# EasyEDA Pro project ProPrj_Line_follow_3_2025-06-26.epro, schematic Schematic1
Board Name: Board1; Create Date: 2025-04-30; Page Name: P1; Project Name: Line_follow_3; Schematic Name: Schematic1; Update Date: 2025-05-01; Company: EasyEDA.com; Page Size: A2; Version: V1.0
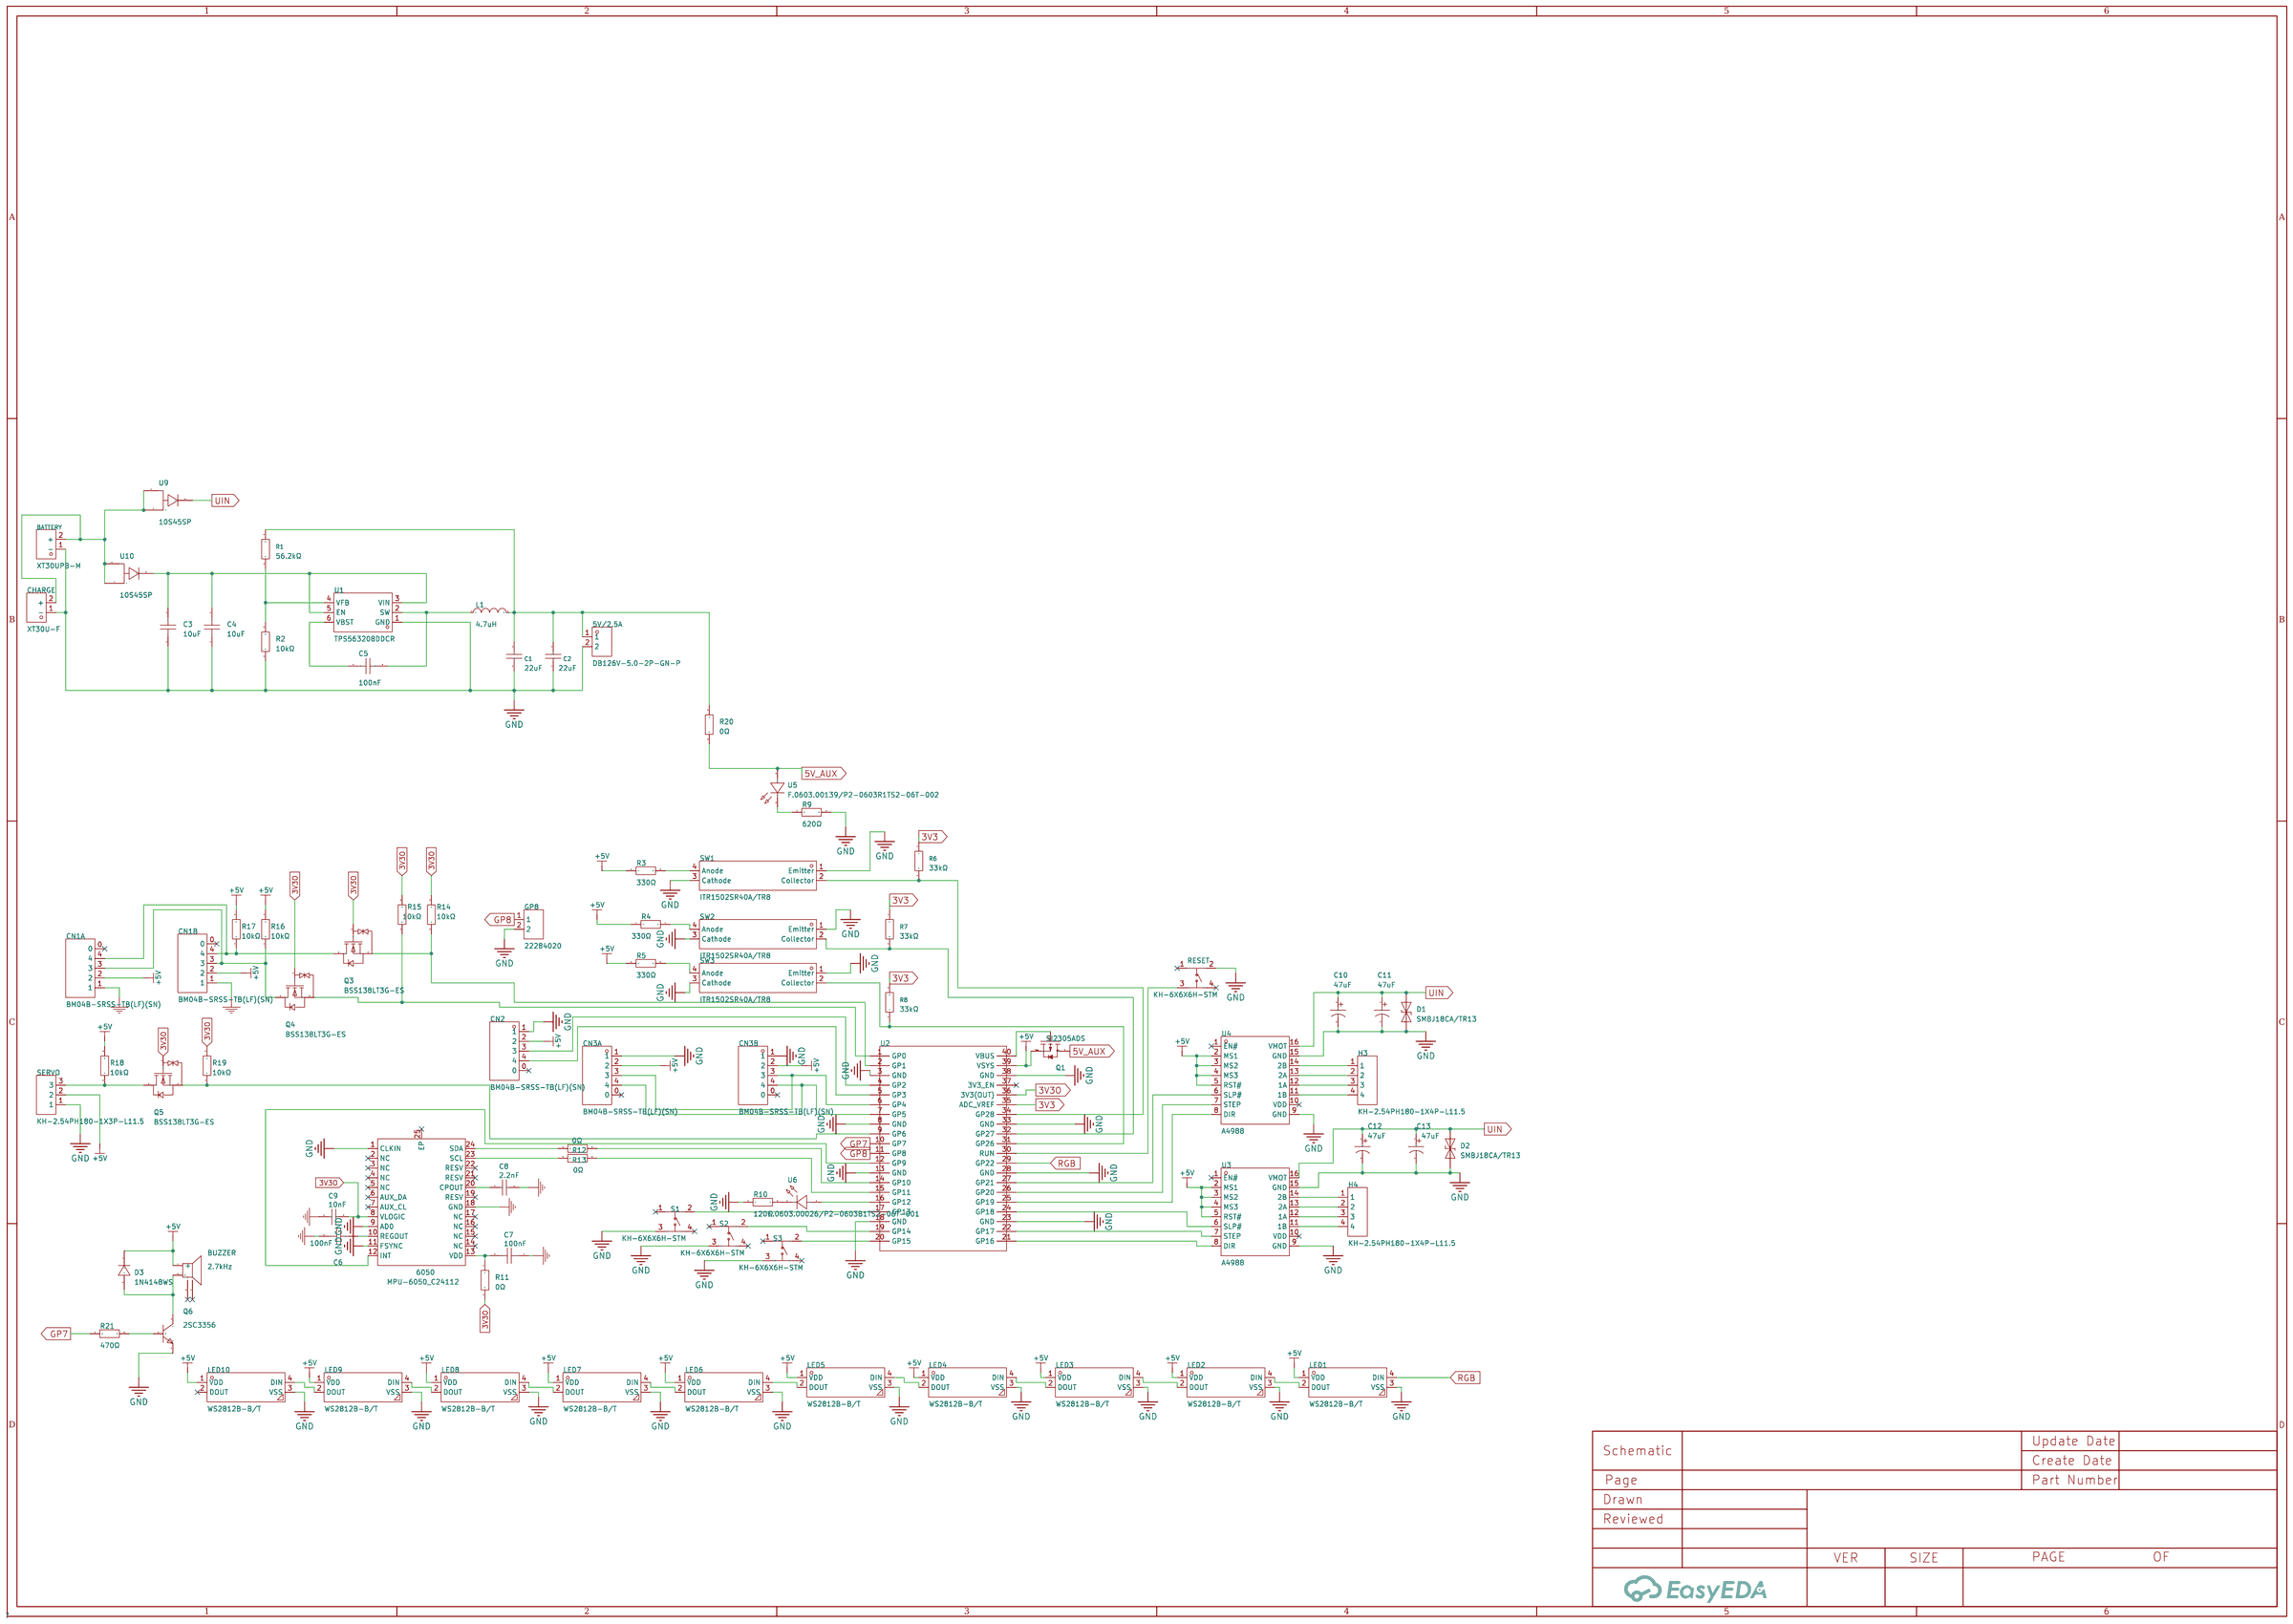
[diagram p0: schematic sheet]

## Parts
5V/2.5A  DB126V-5.0-2P-GN-P  [CONN-TH_2P-P5.00_L7.8-W10.0]
6050  MPU-6050_C24112  [QFN-24_L4.0-W4.0-P0.50-BL-EP2.7]
BATTERY  XT30UPB-M  [CONN-TH_XT30UPB-M]
BUZZER  2.7kHz  [BUZ-SMD_4P-L8.5-W8.5-P8.50-BR]
C1  22uF  [C1210]
C2  22uF  [C1210]
C3  10uF  [C1206]
C4  10uF  [C1206]
C5  100nF  [C0603]
C6  100nF  [C0603]
C7  100nF  [C0603]
C8  2.2nF  [C0603]
C9  10nF  [C0603]
C10  47uF  [CAP-TH_BD6.3-P2.50-D1.0-FD]
C11  47uF  [CAP-TH_BD6.3-P2.50-D1.0-FD]
C12  47uF  [CAP-TH_BD6.3-P2.50-D1.0-FD]
C13  47uF  [CAP-TH_BD6.3-P2.50-D1.0-FD]
CHARGE  XT30U-F  [CONN-TH_XT30U-F]
CN1A  BM04B-SRSS-TB(LF)(SN)  [CONN-SMD_BM04B-SRSS-TB]
CN1B  BM04B-SRSS-TB(LF)(SN)  [CONN-SMD_BM04B-SRSS-TB]
CN2  BM04B-SRSS-TB(LF)(SN)  [CONN-SMD_BM04B-SRSS-TB]
CN3A  BM04B-SRSS-TB(LF)(SN)  [CONN-SMD_BM04B-SRSS-TB]
CN3B  BM04B-SRSS-TB(LF)(SN)  [CONN-SMD_BM04B-SRSS-TB]
D1  SMBJ18CA/TR13  [SMB_L4.6-W3.6-LS5.3-BI]
D2  SMBJ18CA/TR13  [SMB_L4.6-W3.6-LS5.3-BI]
D3  1N4148WS  [SOD-323_L1.8-W1.3-LS2.5-RD]
GP8  22284020  [HDR-TH_2P-P2.54-V-M-1]
H3  KH-2.54PH180-1X4P-L11.5  [HDR-TH_4P-P2.54-V-M]
H4  KH-2.54PH180-1X4P-L11.5  [HDR-TH_4P-P2.54-V-M]
L1  4.7uH  [IND-SMD_L7.0-W6.6]
LED1  WS2812B-B/T  [LED-SMD_4P-L5.0-W5.0-TL_WS2812B-B]
LED2  WS2812B-B/T  [LED-SMD_4P-L5.0-W5.0-TL_WS2812B-B]
LED3  WS2812B-B/T  [LED-SMD_4P-L5.0-W5.0-TL_WS2812B-B]
LED4  WS2812B-B/T  [LED-SMD_4P-L5.0-W5.0-TL_WS2812B-B]
LED5  WS2812B-B/T  [LED-SMD_4P-L5.0-W5.0-TL_WS2812B-B]
LED6  WS2812B-B/T  [LED-SMD_4P-L5.0-W5.0-TL_WS2812B-B]
LED7  WS2812B-B/T  [LED-SMD_4P-L5.0-W5.0-TL_WS2812B-B]
LED8  WS2812B-B/T  [LED-SMD_4P-L5.0-W5.0-TL_WS2812B-B]
LED9  WS2812B-B/T  [LED-SMD_4P-L5.0-W5.0-TL_WS2812B-B]
LED10  WS2812B-B/T  [LED-SMD_4P-L5.0-W5.0-TL_WS2812B-B]
Q1  SI2305ADS  [SOT-23-3_L2.9-W1.3-P1.90-LS2.4-BR]
Q3  BSS138LT3G-ES  [SOT-23-3_L2.9-W1.3-P1.90-LS2.4-BR]
Q4  BSS138LT3G-ES  [SOT-23-3_L2.9-W1.3-P1.90-LS2.4-BR]
Q5  BSS138LT3G-ES  [SOT-23-3_L2.9-W1.3-P1.90-LS2.4-BR]
Q6  2SC3356  [SOT-23-3_L2.9-W1.3-P1.90-LS2.4-BR]
R1  56.2kΩ  [R0402]
R2  10kΩ  [R0402]
R3  330Ω  [R0603]
R4  330Ω  [R0603]
R5  330Ω  [R0603]
R6  33kΩ  [R0603]
R7  33kΩ  [R0603]
R8  33kΩ  [R0603]
R9  620Ω  [R0603]
R10  120Ω  [R0603]
R11  0Ω  [R0603]
R12  0Ω  [R0603]
R13  0Ω  [R0603]
R14  10kΩ  [R0603]
R15  10kΩ  [R0603]
R16  10kΩ  [R0603]
R17  10kΩ  [R0603]
R18  10kΩ  [R0603]
R19  10kΩ  [R0603]
R20  0Ω  [R0603]
R21  470Ω  [R0603]
RESET  KH-6X6X6H-STM  [SW-SMD_4P-L6.0-W6.0-P4.50-LS9.0-3]
S1  KH-6X6X6H-STM  [SW-SMD_4P-L6.0-W6.0-P4.50-LS9.0-3]
S2  KH-6X6X6H-STM  [SW-SMD_4P-L6.0-W6.0-P4.50-LS9.0-3]
S3  KH-6X6X6H-STM  [SW-SMD_4P-L6.0-W6.0-P4.50-LS9.0-3]
SERVO  KH-2.54PH180-1X3P-L11.5  [HDR-TH_3P-P2.54-V-M]
SW1  ITR1502SR40A/TR8  [SW-SMD_4P-L4.0-W3.0_ITR1502SR40A-TR8]
SW2  ITR1502SR40A/TR8  [SW-SMD_4P-L4.0-W3.0_ITR1502SR40A-TR8]
SW3  ITR1502SR40A/TR8  [SW-SMD_4P-L4.0-W3.0_ITR1502SR40A-TR8]
U1  TPS563208DDCR  [TSOT-23-6_L2.9-W1.6-P0.95-LS2.8-BL]
U2  -  [RPI_PICO_DIL]
U3  A4988  [DIP-16_L20.3-W15.2-P2.54_LS12.7_A4988]
U4  A4988  [DIP-16_L20.3-W15.2-P2.54_LS12.7_A4988]
U5  F.0603.00139/P2-0603R1TS2-06T-002  [LED0603-RD]
U6  F.0603.00026/P2-0603B1TS2-06T-001  [LED0603-RD]
U9  10S45SP  [TO-277_3P-L5.4-W4.0-LS6.5-TR-1]
U10  10S45SP  [TO-277_3P-L5.4-W4.0-LS6.5-TR-1]

## Library data of the parts
5V/2.5A = DB126V-5.0-2P-GN-P: Structure:1x2P Pitch:5mm Color:Green Mounting Style:Straight Current Rating (Max):15A Voltage Rating (Max):250V Number of Pins:2P Number of Rows:1 Wire Gauge - AWG:14~26 Wire Gauge - AWG:14~26 Wire Gauge - mm2:1.5 Wire Gauge - mm2:1.5 Number of PINs Per R; LCSC Part Name: 5mm 1x2P 排数:1 每排P数:2 直插; Supplier Part: C395849; Manufacturer: DORABO(地博电气); Supplier Footprint: 插件,P=5mm; JLCPCB Part Class: Extended Part; Datasheet: https://atta.szlcsc.com/upload/public/pdf/source/20230406/A033F46F5FECA00BC1B8D9A3F749A51C.pdf; Supplier: LCSC; Structure: 1x2P; Pitch: 5mm; Color: Green; Mounting Style: Straight; Current Rating (Max): 15A; Voltage Rating (Max): 250V; Number of Pins: 2P; Number of Rows: 1; Wire Gauge - AWG: 14~26; Wire Gauge - mm2: 1.5; Number of PINs Per Row: 2; Operating Temperature Range: -40℃~+105℃
6050 = MPU-6050_C24112: Supplier: LCSC; Manufacturer: TDK InvenSense(应美盛); Manufacturer Part: MPU-6050; Supplier Part: C24112; JLCPCB Part Class: Extended Part
BATTERY = XT30UPB-M: Brand:艾迈斯 Model:XT30UPB-M Power:- Output:- Input:- Size:- Interface:- Type:- Colour:Yellow MaximumCurrent:- Type:航模插头 RatedVoltage:DC 500V Type1:- NumberOfUSBHoles:- InterfaceType:公头 MetalMaterial:镀金 InsulationMaterial:PA RatedCurrent:15A RecommendedWireG; LCSC Part Name: AMASS(艾迈斯)板载立式 航模锂电池控制器连接器插头 公头XT30UPB-M; Supplier Part: C428721; Manufacturer: AMASS(艾迈斯); JLCPCB Part Class: Extended Part; Datasheet: https://atta.szlcsc.com/upload/public/pdf/source/20230412/7B5DFEF57C9EA5273853390C734B3AC5.pdf; Supplier: LCSC; Brand: 艾迈斯; Type: 航模插头; Colour: Yellow; RatedVoltage: DC 500V; InterfaceType: 公头; MetalMaterial: 镀金; InsulationMaterial: PA; RatedCurrent: 15A; contact resistance: 0.65mΩ
BUZZER = MLT-8530: Driver Circuitry:Passive (external drive) Technology:Electromagnetic Type Voltage - Supply:2.5V~4.5V Voltage - Supply:2.5V~4.5V Frequency:2.7kHz Sound Pressure Level(SPL):80dB Length:8.5mm Width:8.5mm Height:3.3mm; Supplier Part: C94599; Manufacturer: 华能; Supplier Footprint: SMD,8.5x8.5mm; JLCPCB Part Class: Extended Part; Datasheet: https://atta.szlcsc.com/upload/public/pdf/source/20170522/1495448322339.pdf; Supplier: LCSC; Driver Circuitry: Passive (external drive); Technology: Electromagnetic Type; Voltage - Supply: 2.5V~4.5V; Sound Pressure Level(SPL): 80dB; Length: 8.5mm; Width: 8.5mm; Height: 3.3mm
C1 C2 = GRM32ER61E226KE15L: Capacitance: Tolerance:±10% Tolerance:±10% Voltage Rated: Temperature Coefficient:; LCSC Part Name: 22uF ±10% 25V; Supplier Part: C65428; Manufacturer: muRata(村田); Supplier Footprint: 1210; JLCPCB Part Class: Extended Part; Datasheet: https://atta.szlcsc.com/upload/public/pdf/source/20161108/1478586380821.pdf; Supplier: LCSC; Tolerance: ±10%
C3 C4 = GRM31CR61E106KA12L: Capacitance: Tolerance:±10% Tolerance:±10% Voltage Rated: Temperature Coefficient:; LCSC Part Name: 10uF ±10% 25V; Supplier Part: C77090; Manufacturer: muRata(村田); Supplier Footprint: 1206; JLCPCB Part Class: Extended Part; Datasheet: https://atta.szlcsc.com/upload/public/pdf/source/20220406/666EA4B36F44A2579D2587BF03644D37.pdf; Supplier: LCSC; Tolerance: ±10%
C5 = GRM188R71H104KA93D: Capacitance: Tolerance:±10% Tolerance:±10% Voltage Rated: Temperature Coefficient:; LCSC Part Name: 100nF ±10% 50V; Supplier Part: C77055; Manufacturer: muRata(村田); Supplier Footprint: 0603; JLCPCB Part Class: Extended Part; Datasheet: https://atta.szlcsc.com/upload/public/pdf/source/20200305/C490387_23319AE8C154DEB24C505E6C82A8106A.pdf; Supplier: LCSC; Tolerance: ±10%
C6 C7 = 100nF: Supplier: LCSC; Manufacturer: SAMSUNG(三星); Manufacturer Part: CL10B104KB8NNNC; Supplier Part: C1591; JLCPCB Part Class: Extended Part
C8 = 2.2nF: Supplier: LCSC; Manufacturer: FH(风华); Manufacturer Part: 0603B222K500NT; Supplier Part: C1604; JLCPCB Part Class: Basic Part
C9 = 10nF: Supplier: LCSC; Manufacturer Part: CL10B103KB8NNNC; Manufacturer: SAMSUNG(三星); Supplier Part: C1589; JLCPCB Part Class: Extended Part
C10-C13 = SPZ1HM470E08O00RAXXX: Capacitance:47uF Tolerance:±20% Tolerance:±20% Voltage Rating:50V Ripple Current:2.1A@100kHz Equivalent Series Resistance(ESR):35mΩ@100kHz Type:- Pin Spacing:2.5mm Diameter:6.3mm Height - Seated (Max):8mm Lifetime:2000hrs@105℃ Operating Temperature:-55℃~+; LCSC Part Name: 47uF ±20% 50V 工业级; Supplier Part: C122243; Manufacturer: AISHI(艾华集团); Supplier Footprint: 插件,D6.3xL8mm; JLCPCB Part Class: Extended Part; Datasheet: https://atta.szlcsc.com/upload/public/pdf/source/20180126/C160185_15169514739121308228.pdf; Supplier: LCSC; Tolerance: ±20%; Voltage Rating: 50V; Ripple Current: 2.1A@100kHz; Equivalent Series Resistance(ESR): 35mΩ@100kHz; Pin Spacing: 2.5mm; Diameter: 6.3mm; Height - Seated (Max): 8mm; Lifetime: 2000hrs@105℃; Operating Temperature: -55℃~+105℃
CHARGE = XT30U-F: Brand:艾迈斯 Model:XT30U-F Power:- Output:- Input:- Size:- Interface:- Type:- Colour:Yellow MaximumCurrent:- Type:Plug RatedVoltage:- Type1:- NumberOfUSBHoles:- InterfaceType:母头 MetalMaterial:- InsulationMaterial:- RatedCurrent:- RecommendedWireGauge:- Flame; LCSC Part Name: AMASS(艾迈斯)轻量版锂电池插头母头 XT30U-F; Supplier Part: C99102; Manufacturer: AMASS(艾迈斯); JLCPCB Part Class: Extended Part; Datasheet: https://atta.szlcsc.com/upload/public/pdf/source/20190916/C428721_B0ECB8C5937139CEFE8736D2D3175B0E.pdf; Supplier: LCSC; Brand: 艾迈斯; Type: Plug; Colour: Yellow; InterfaceType: 母头
CN1A CN1B = BM04B-SRSS-TB(LF)(SN): Supplier: LCSC; Supplier Part: C160390; Manufacturer: JST; JLCPCB Part Class: Extended Part
CN2 CN3A CN3B = BM04B-SRSS-TB(LF)(SN): Pins Structure:1x4P Pitch:1mm Mounting Style:Standing paste Reference Series:SH Number of Pins:4P Number of Rows:1 Number of PINs Per Row:4 Row Spacing:- Current Rating (Max):1A Contact Material:Copper alloy Contact Plating:Tin Operating Temperature Range; LCSC Part Name: 1x4P 间距:1mm 立贴 系列:SH; Supplier Part: C160390; Manufacturer: JST; Supplier Footprint: SMD,P=1mm; JLCPCB Part Class: Extended Part; Datasheet: https://atta.szlcsc.com/upload/public/pdf/source/20181008/C268118_5C0FE2784716D1E5DD0A36233D1E1F34.pdf; Supplier: LCSC; Pins Structure: 1x4P; Pitch: 1mm; Mounting Style: Standing paste; Reference Series: SH; Number of Pins: 4P; Number of Rows: 1; Number of PINs Per Row: 4; Current Rating (Max): 1A; Contact Material: Copper alloy; Contact Plating: Tin; Operating Temperature Range: -25℃~+85℃; Rated Voltage (Max): 50V; Plastic Material: PA; Flame Retardant Rating: UL94V-0; Supplementary Features: Auxiliary soldering legs; Colour: White; Z-Height of the Board: 4.25mm; X-Length of Bottom Edge on Board (Spacing Line): 6mm; Y-Width of Bottom Edge on Board: 3.6mm
D1 D2 = SMBJ18CA/TR13_C78413: Reverse Stand-Off Voltage (Vrwm):18V Maximum Clamping Voltage:29.2V Peak Pulse Current (Ipp):20.6A Peak Pulse Power Dissipation (Ppp):600W Breakdown Voltage:20V Type:TVS; LCSC Part Name: 18V截止 20.6A峰值脉冲; Supplier Part: C78413; Manufacturer: Brightking(君耀电子); Supplier Footprint: SMB(DO-214AA); JLCPCB Part Class: Extended Part; Datasheet: https://atta.szlcsc.com/upload/public/pdf/source/20181127/C309995_EB3DFB9F9AEE5D2146ECD9FA5992A402.pdf; Supplier: LCSC; Reverse Stand-Off Voltage (Vrwm): 18V; Maximum Clamping Voltage: 29.2V; Peak Pulse Current (Ipp): 20.6A; Peak Pulse Power Dissipation (Ppp): 600W; Breakdown Voltage: 20V; Type: TVS
D3 = 1N4148WS_C2128: Diode Configuration:Independent Type Forward Voltage (Vf@If):1.25V@150mA Reverse Voltage (Vr): Rectified Current: Reverse Leakage Current (Ir):1uA@75V Reverse Recovery Time (trr): Operating Temperature:- Operating Temperature:-; LCSC Part Name: 丝印T4; Supplier Part: C2128; Manufacturer: CJ(江苏长电/长晶); Supplier Footprint: SOD-323; JLCPCB Part Class: Basic Part; Datasheet: https://atta.szlcsc.com/upload/public/pdf/source/20140809/1457707208178.pdf; Supplier: LCSC; Diode Configuration: Independent Type; Forward Voltage (Vf@If): 1.25V@150mA; Reverse Leakage Current (Ir): 1uA@75V
GP8 = 22284020: Pin Structure:1x2P Pitch:2.54mm Row Spacing:- Circluar Pins/Square Pins:Policy Mounting Type:Straight Number of Rows:Single Row Number of Pins:2P Current Rating:- Voltage Rating (Max):- Length of Mating Pin:- Insulation Height:- Contact Material:Brass Con; LCSC Part Name: 1x2P 间距:2.54mm 方针 直插; Supplier Part: C234182; Manufacturer: MOLEX; Supplier Footprint: 插件,P=2.54mm; JLCPCB Part Class: Extended Part; Datasheet: https://www.molex.com/content/dam/molex/molex-dot-com/products/automated/en-us/salesdrawingpdf/423/42375/022284020_sd.pdf?inline\; Supplier: LCSC; Pin Structure: 1x2P; Pitch: 2.54mm; Circluar Pins/Square Pins: Policy; Mounting Type: Straight; Number of Rows: Single Row; Number of Pins: 2P; Contact Material: Brass; Color: Black
H3 H4 = KH-2.54PH180-1X4P-L11.5: Pin Structure:1x4P Pitch:2.54mm Row Spacing:- Circluar Pins/Square Pins:Policy Mounting Type:Straight Number of Rows:Single Row Number of Pins:4P Current Rating:3A Voltage Rating (Max):- Length of Mating Pin:6mm Insulation Height:2.5mm Length of End Conne; LCSC Part Name: 1x4P 间距:2.54mm 方针 直插; Supplier Part: C2905435; Manufacturer: kinghelm(金航标); Supplier Footprint: 插件,P=2.54mm; JLCPCB Part Class: Extended Part; Datasheet: https://atta.szlcsc.com/upload/public/pdf/source/20211019/06FD9EA041E66F176E900F61FE678D35.pdf; Supplier: LCSC; Pin Structure: 1x4P; Pitch: 2.54mm; Circluar Pins/Square Pins: Policy; Mounting Type: Straight; Number of Rows: Single Row; Number of Pins: 4P; Current Rating: 3A; Length of Mating Pin: 6mm; Insulation Height: 2.5mm; Length of End Connection Pin: 3mm; Operating Temperature: -40℃~+105℃; Color: Black
L1 = FXL0630-4R7-M: Inductance: Tolerance:±20% Tolerance:±20% Rated Current: Saturation Current (Isat):9A DC Resistance (DCR): Type:Integrated molded inductor; LCSC Part Name: 4.7uH ±20% 9A; Supplier Part: C167220; Manufacturer: cjiang(长江微电); Supplier Footprint: SMD,6.6x7mm; JLCPCB Part Class: Extended Part; Datasheet: https://atta.szlcsc.com/upload/public/pdf/source/20240426/3189EA8206330E2108542F9E34E540E7.pdf; Supplier: LCSC; Tolerance: ±20%; Saturation Current (Isat): 9A; Type: Integrated molded inductor
LED1-LED10 = WS2812B-B/T: Wavelength:520nm；471nm；621nm Luminous Intensity:- Fixed-Frequency Pwm Mode:- Data Transmission Rate:- Supply Voltage:- Supply Voltage:- Quiescent Dissipation:- Lens Color:-; LCSC Part Name: RGB三色; Supplier Part: C2761795; Manufacturer: worldsemi; Supplier Footprint: SMD5050; JLCPCB Part Class: Extended Part; Datasheet: https://atta.szlcsc.com/upload/public/pdf/source/20241202/30EABD03362326C22309ED3654C53350.pdf; Supplier: LCSC; Wavelength: 520nm；471nm；621nm
Q1 = SI2305ADS: Drain to Source Voltage:20V Current - Continuous Drain(Id): RDS(on):- Pd - Power Dissipation:1.7W Gate Threshold Voltage (Vgs(th)@Id):- Gate Charge(Qg):7.8nC@4.5V Input Capacitance(Ciss@Vds):740pF@4V Reverse Transfer Capacitance (Crss@Vds):190pF@4V Operat; LCSC Part Name: 耐压:20V 电流:4.1A; Supplier Part: C5182096; Manufacturer: TECH PUBLIC(台舟); Supplier Footprint: SOT-23; JLCPCB Part Class: Extended Part; Datasheet: https://atta.szlcsc.com/upload/public/pdf/source/20220927/00534EBDE53C483832294214EA91FD80.pdf; Supplier: LCSC; Drain to Source Voltage: 20V; Pd - Power Dissipation: 1.7W; Gate Charge(Qg): 7.8nC@4.5V; Input Capacitance(Ciss@Vds): 740pF@4V; Reverse Transfer Capacitance (Crss@Vds): 190pF@4V; Operating Temperature: -55℃~+150℃
Q3-Q5 = BSS138LT3G-ES: Supplier: LCSC; Supplier Part: C5224268; Manufacturer: ElecSuper(静芯微); JLCPCB Part Class: Extended Part
Q6 = 2SC3356_C28646266: type:NPN Current - Collector(Ic): Collector - Emitter Voltage VCEO:12V Pd - Power Dissipation:200mW DC Current Gain:250@20mA,10V DC Current Gain:250@20mA,10V Transition frequency(fT):7000MHz Current - Collector Cutoff:1uA Vce Saturation(VCE(sat)):300mV Op; Supplier Part: C28646266; Manufacturer: 宏嘉诚; Supplier Footprint: SOT-23; JLCPCB Part Class: Extended Part; Datasheet: https://atta.szlcsc.com/upload/public/pdf/source/20250107/0E7AF9BB0470D7B773F879ABCF14D42F.pdf; Supplier: LCSC; type: NPN; Collector - Emitter Voltage VCEO: 12V; Pd - Power Dissipation: 200mW; DC Current Gain: 250@20mA,10V; Transition frequency(fT): 7000MHz; Current - Collector Cutoff: 1uA; Vce Saturation(VCE(sat)): 300mV; Operating Temperature: -55℃~+150℃
R1 = 0402WGF5622TCE: Type:Thick Film Resistors Resistance:56.2kΩ Tolerance:±1% Tolerance:±1% Power(Watts): Overload Voltage (Max): Temperature Coefficient:±100ppm/℃ Temperature Coefficient:±100ppm/℃ Operating Temperature Range:-55℃~+155℃ Operating Temperature Range:-55℃~+155℃; LCSC Part Name: 56.2kΩ ±1% 62.5mW 厚膜电阻; Supplier Part: C54968; Manufacturer: UNI-ROYAL(厚声); Supplier Footprint: 0402; JLCPCB Part Class: Extended Part; Datasheet: https://atta.szlcsc.com/upload/public/pdf/source/20200306/C422600_1E6D84923E4A46A82E41ADD87F860B5C.pdf; Supplier: LCSC; Type: Thick Film Resistors; Tolerance: ±1%; Temperature Coefficient: ±100ppm/℃; Operating Temperature Range: -55℃~+155℃
R2 = 0402WGF1002TCE: Type:Thick Film Resistors Resistance:10kΩ Tolerance:±1% Tolerance:±1% Power(Watts): Overload Voltage (Max): Temperature Coefficient:±100ppm/℃ Temperature Coefficient:±100ppm/℃ Operating Temperature Range:-55℃~+155℃ Operating Temperature Range:-55℃~+155℃; LCSC Part Name: 10kΩ ±1% 62.5mW 厚膜电阻; Supplier Part: C25744; Manufacturer: UNI-ROYAL(厚声); Supplier Footprint: 0402; JLCPCB Part Class: Basic Part; Datasheet: https://atta.szlcsc.com/upload/public/pdf/source/20200306/C422600_1E6D84923E4A46A82E41ADD87F860B5C.pdf; Supplier: LCSC; Type: Thick Film Resistors; Tolerance: ±1%; Temperature Coefficient: ±100ppm/℃; Operating Temperature Range: -55℃~+155℃
R3-R5 = 0603WAF3300T5E: Type:Thick Film Resistors Resistance: Tolerance:±1% Tolerance:±1% Power(Watts): Overload Voltage (Max): Temperature Coefficient:±100ppm/℃ Temperature Coefficient:±100ppm/℃ Operating Temperature Range:-55℃~+155℃ Operating Temperature Range:-55℃~+155℃; LCSC Part Name: 330Ω ±1% 100mW 厚膜电阻; Supplier Part: C23138; Manufacturer: UNI-ROYAL(厚声); Supplier Footprint: 0603; JLCPCB Part Class: Basic Part; Datasheet: https://atta.szlcsc.com/upload/public/pdf/source/20200306/C422600_1E6D84923E4A46A82E41ADD87F860B5C.pdf; Supplier: LCSC; Type: Thick Film Resistors; Tolerance: ±1%; Temperature Coefficient: ±100ppm/℃; Operating Temperature Range: -55℃~+155℃
R6-R8 = 0603WAF3302T5E: Type:Thick Film Resistors Resistance:33kΩ Tolerance:±1% Tolerance:±1% Power(Watts): Overload Voltage (Max): Temperature Coefficient:±100ppm/℃ Temperature Coefficient:±100ppm/℃ Operating Temperature Range:-55℃~+155℃ Operating Temperature Range:-55℃~+155℃; LCSC Part Name: 33kΩ ±1% 100mW 厚膜电阻; Supplier Part: C4216; Manufacturer: UNI-ROYAL(厚声); Supplier Footprint: 0603; JLCPCB Part Class: Basic Part; Datasheet: https://atta.szlcsc.com/upload/public/pdf/source/20200306/C422600_1E6D84923E4A46A82E41ADD87F860B5C.pdf; Supplier: LCSC; Type: Thick Film Resistors; Tolerance: ±1%; Temperature Coefficient: ±100ppm/℃; Operating Temperature Range: -55℃~+155℃
R9 = RC0603FR-07620RL: Type:Thick Film Resistors Resistance: Tolerance:±1% Tolerance:±1% Power(Watts): Overload Voltage (Max): Temperature Coefficient:±100ppm/℃ Temperature Coefficient:±100ppm/℃ Operating Temperature Range:-55℃~+155℃ Operating Temperature Range:-55℃~+155℃; LCSC Part Name: 厚膜电阻 620Ω ±1% 100mW; Supplier Part: C137695; Manufacturer: YAGEO(国巨); Supplier Footprint: 0603; JLCPCB Part Class: Extended Part; Datasheet: https://atta.szlcsc.com/upload/public/pdf/source/20180821/C275644_0D56F95EFF785E7D9A1FEF436B37DA78.pdf; Supplier: LCSC; Type: Thick Film Resistors; Tolerance: ±1%; Temperature Coefficient: ±100ppm/℃; Operating Temperature Range: -55℃~+155℃
R10 = RC0603FR-07120RL: Type:Thick Film Resistors Resistance: Tolerance:±1% Tolerance:±1% Power(Watts): Overload Voltage (Max): Temperature Coefficient:±100ppm/℃ Temperature Coefficient:±100ppm/℃ Operating Temperature Range:-55℃~+155℃ Operating Temperature Range:-55℃~+155℃; LCSC Part Name: 厚膜电阻 120Ω ±1% 100mW; Supplier Part: C114640; Manufacturer: YAGEO(国巨); Supplier Footprint: 0603; JLCPCB Part Class: Extended Part; Datasheet: https://atta.szlcsc.com/upload/public/pdf/source/20180821/C275644_0D56F95EFF785E7D9A1FEF436B37DA78.pdf; Supplier: LCSC; Type: Thick Film Resistors; Tolerance: ±1%; Temperature Coefficient: ±100ppm/℃; Operating Temperature Range: -55℃~+155℃
R11-R13 R20 = 0Ω: Supplier: LCSC; Manufacturer: UNI-ROYAL(厚声); Manufacturer Part: 0603WAJ0000T5E; Supplier Part: C15402; JLCPCB Part Class: Extended Part
R14-R19 = 10kΩ: Supplier: LCSC; Manufacturer: YAGEO(国巨); Manufacturer Part: AC0603FR-0710KL; Supplier Part: C116677; JLCPCB Part Class: Extended Part
R21 = 0603WAF4700T5E: Type:Thick Film Resistors Resistance: Tolerance:±1% Tolerance:±1% Power(Watts): Overload Voltage (Max): Temperature Coefficient:±100ppm/℃ Temperature Coefficient:±100ppm/℃ Operating Temperature Range:-55℃~+155℃ Operating Temperature Range:-55℃~+155℃; LCSC Part Name: 470Ω ±1% 100mW 厚膜电阻; Supplier Part: C23179; Manufacturer: UNI-ROYAL(厚声); Supplier Footprint: 0603; JLCPCB Part Class: Basic Part; Datasheet: https://atta.szlcsc.com/upload/public/pdf/source/20200306/C422600_1E6D84923E4A46A82E41ADD87F860B5C.pdf; Supplier: LCSC; Type: Thick Film Resistors; Tolerance: ±1%; Temperature Coefficient: ±100ppm/℃; Operating Temperature Range: -55℃~+155℃
RESET S1-S3 = KH-6X6X6H-STM: Circuit:SPST Actuator Style:Round Button Mounting Style:Brick nogging Switch Length:6mm Switch Width:6mm Switch Height:6mm Strike Gundam:不带 Contact Current:50mA Voltage Rating (DC):12V Actuator/Cap Color:Black Pin Style:Gull Wing Mechanical Life:8万次; LCSC Part Name: 6*6*6mm 立贴 轻触开关; Supplier Part: C2837532; Manufacturer: kinghelm(金航标); Supplier Footprint: SMD; JLCPCB Part Class: Extended Part; Datasheet: https://atta.szlcsc.com/upload/public/pdf/source/20210608/C2837532_E316B9464CED229D1EEC211AA57656A9.pdf; Supplier: LCSC; Circuit: SPST; Actuator Style: Round Button; Mounting Style: Brick nogging; Switch Length: 6mm; Switch Width: 6mm; Switch Height: 6mm; Strike Gundam: 不带; Contact Current: 50mA; Voltage Rating (DC): 12V; Actuator/Cap Color: Black; Pin Style: Gull Wing; Mechanical Life: 8万次
SERVO = KH-2.54PH180-1X3P-L11.5: Pin Structure:1x3P Pitch:2.54mm Row Spacing:- Circluar Pins/Square Pins:Policy Mounting Type:Straight Number of Rows:Single Row Number of Pins:3P Current Rating:3A Voltage Rating (Max):- Length of Mating Pin:6mm Insulation Height:2.5mm Length of End Conne; LCSC Part Name: 1x3P 间距:2.54mm 方针 直插; Supplier Part: C2932698; Manufacturer: kinghelm(金航标); Supplier Footprint: 插件,P=2.54mm; JLCPCB Part Class: Extended Part; Datasheet: https://atta.szlcsc.com/upload/public/pdf/source/20211220/D2AB060C07EA7DD91A5B4AA994AB98CA.pdf; Supplier: LCSC; Pin Structure: 1x3P; Pitch: 2.54mm; Circluar Pins/Square Pins: Policy; Mounting Type: Straight; Number of Rows: Single Row; Number of Pins: 3P; Current Rating: 3A; Length of Mating Pin: 6mm; Insulation Height: 2.5mm; Length of End Connection Pin: 3mm; Operating Temperature: -40℃~+105℃; Color: Black
SW1-SW3 = ITR1502SR40A/TR8: Supplier Part: C183793; Manufacturer: EVERLIGHT(亿光); Supplier Footprint: SMD; JLCPCB Part Class: Extended Part; Datasheet: https://atta.szlcsc.com/upload/public/pdf/source/20210824/788DB0FEA34120D89E4A3F95527B4996.pdf; Supplier: LCSC
U1 = TPS563208DDCR: Function:Step-down type Output Type:Adjustable Input Voltage:4.5V~17V Input Voltage:4.5V~17V Output Voltage:768mV~7V Output Voltage:768mV~7V Output Current:3A Switching Frequency:580kHz Switching Frequency:580kHz Operating Temperature:-40℃~+125℃@(TJ) Oper; LCSC Part Name: 4.5V至17V输入、3A同步降压电压调节器; Supplier Part: C468250; Manufacturer: TI(德州仪器); Supplier Footprint: TSOT-23-6; JLCPCB Part Class: Extended Part; Datasheet: https://www.ti.com/cn/lit/gpn/tps563208; Supplier: LCSC; Function: Step-down type; Output Type: Adjustable; Input Voltage: 4.5V~17V; Output Voltage: 768mV~7V; Output Current: 3A; Switching Frequency: 580kHz; Operating Temperature: -40℃~+125℃@(TJ); Synchronous Rectification: Yes; Number of Outputs: 1; Topology: Step-down; Switch tube (built-in/external): Built-in
U2 = RPI_PICO_DIL: Raspberry pi pico in DIL
U3 U4 = A4988: Supplier Part: C9900168373; Supplier Footprint: 插件; Supplier: LCSC
U5 = F.0603.00139/P2-0603R1TS2-06T-002: Emitted Color:Red Forward Current:- Lens Color:- Viewing Angle:120° Operating Temperature:-40℃~+85℃ Operating Temperature:-40℃~+85℃; Supplier Part: C7496820; Manufacturer: TUOZHAN(拓展光电); Supplier Footprint: 0603; JLCPCB Part Class: Extended Part; Datasheet: https://atta.szlcsc.com/upload/public/pdf/source/20230809/2283CFC12D1EC1C972D0489FE4CEE0B0.pdf; Supplier: LCSC; Emitted Color: Red; Viewing Angle: 120°; Operating Temperature: -40℃~+85℃
U6 = F.0603.00026/P2-0603B1TS2-06T-001: Emitted Color:Blue Forward Current:- Lens Color:- Viewing Angle:120° Operating Temperature:-40℃~+85℃ Operating Temperature:-40℃~+85℃; Supplier Part: C7496819; Manufacturer: TUOZHAN(拓展光电); Supplier Footprint: 0603; JLCPCB Part Class: Extended Part; Datasheet: https://atta.szlcsc.com/upload/public/pdf/source/20230809/ECF6953856A20A27FF1AE7121E51C3D2.pdf; Supplier: LCSC; Emitted Color: Blue; Viewing Angle: 120°; Operating Temperature: -40℃~+85℃
U9 U10 = 10S45SP: Diode Configuration:Independent Type Voltage - Forward(Vf@If):340mV Voltage - DC Reverse(Vr):45V Current - Rectified:10A Reverse Leakage Current (Ir):50uA; LCSC Part Name: 电压:45V 电流:10A; Supplier Part: C2988031; Manufacturer: YFW(佑风微); Supplier Footprint: TO-277; JLCPCB Part Class: Extended Part; Datasheet: https://atta.szlcsc.com/upload/public/pdf/source/20220407/05C717FA9B3D5E579CF7705D4CF18277.pdf; Supplier: LCSC; Diode Configuration: Independent Type; Voltage - Forward(Vf@If): 340mV; Voltage - DC Reverse(Vr): 45V; Current - Rectified: 10A; Reverse Leakage Current (Ir): 50uA

## Nets
3V3: R6.1 R7.1 R8.2 U2.35(ADC_VREF)
3V3O: 6050.8(VLOGIC) C9.2 Q3.1(G) Q4.1(G) Q5.1(G) R11.2 R14.2 R15.2 R19.2 U2.36(3V3(OUT))
5V_AUX: Q1.3(D) R20.2 U5.2(A)
+5V: BUZZER.1(+) CN1A.2 CN1B.2 CN2.2 CN3A.2 CN3B.2 D3.1(K) LED1.1(VDD) LED2.1(VDD) LED3.1(VDD) LED4.1(VDD) LED5.1(VDD) LED6.1(VDD) LED7.1(VDD) LED8.1(VDD) LED9.1(VDD) LED10.1(VDD) Q1.2(S) R3.1 R4.1 R5.1 R16.2 R17.2 R18.2 SERVO.2 U2.39(VSYS) U3.2(MS1) U3.3(MS2) U3.4(MS3) U3.5(RST#) U4.2(MS1) U4.3(MS2) U4.4(MS3) U4.5(RST#)
GND: 5V/2.5A.2 6050.1(CLKIN) 6050.9(AD0) 6050.11(FSYNC) 6050.18(GND) BATTERY.1(-) C1.2 C2.1 C3.1 C4.1 C6.2 C7.1 C8.2 C9.1 C10.2 C11.2 C12.2 C13.2 CHARGE.1(-) CN1A.1 CN1B.1 CN2.1 CN3A.1 CN3B.1 D1.2 D2.1 GP8.2 LED1.3(VSS) LED2.3(VSS) LED3.3(VSS) LED4.3(VSS) LED5.3(VSS) LED6.3(VSS) LED7.3(VSS) LED8.3(VSS) LED9.3(VSS) LED10.3(VSS) Q6.2(E) R2.1 R9.2 R10.1 RESET.2(B) S1.3(C) S2.3(C) S3.3(C) SERVO.1 SW1.1(Emitter) SW1.3(Cathode) SW2.1(Emitter) SW2.3(Cathode) SW3.1(Emitter) SW3.3(Cathode) U1.1(GND) U2.3(GND) U2.8(GND) U2.13(GND) U2.18(GND) U2.23(GND) U2.28(GND) U2.33(GND) U2.38(GND) U3.9(GND) U3.15(GND) U4.9(GND) U4.15(GND)
GP7: R21.1 U2.10(GP7)
GP8: GP8.1 U2.11(GP8)
RGB: LED1.4(DIN) U2.29(GP22)
UIN: C10.1 C11.1 C12.1 C13.1 D1.1 D2.2 U3.16(VMOT) U4.16(VMOT) U9.3(K)
$1N406: 5V/2.5A.1 C1.1 C2.2 L1.2 R1.2 R20.1
$1N407: C5.2 L1.1 U1.2(SW)
$1N409: C5.1 U1.6(VBST)
$1N1060: H3.1 U4.14(2B)
$1N1064: H3.2 U4.13(2A)
$1N1069: H3.3 U4.12(1A)
$1N1074: H3.4 U4.11(1B)
$1N1086: H4.2 U3.13(2A)
$1N1111: H4.1 U3.14(2B)
$1N1115: H4.3 U3.12(1A)
$1N1120: H4.4 U3.11(1B)
$1N1329: U2.21(GP16) U3.8(DIR)
$1N1335: U2.22(GP17) U3.7(STEP)
$1N1342: U2.24(GP18) U3.6(SLP#)
$1N1376: U2.25(GP19) U4.8(DIR)
$1N1382: U2.26(GP20) U4.7(STEP)
$1N1389: U2.27(GP21) U4.6(SLP#)
$1N1796: R3.2 SW1.4(Anode)
$1N1800: R4.2 SW2.4(Anode)
$1N2119: R6.2 SW1.2(Collector) U2.34(GP28)
$1N2127: R7.2 SW2.2(Collector) U2.32(GP27)
$1N2274: Q1.1(G) U2.40(VBUS)
$1N5206: LED9.2(DOUT) LED10.4(DIN)
$1N5213: LED8.2(DOUT) LED9.4(DIN)
$1N5220: LED7.2(DOUT) LED8.4(DIN)
$1N5227: LED6.2(DOUT) LED7.4(DIN)
$1N5234: LED5.2(DOUT) LED6.4(DIN)
$1N5240: LED4.2(DOUT) LED5.4(DIN)
$1N5248: LED3.2(DOUT) LED4.4(DIN)
$1N5255: LED2.2(DOUT) LED3.4(DIN)
$1N5262: LED1.2(DOUT) LED2.4(DIN)
$1N5322: S1.2(B) U2.17(GP13)
$1N5328: S2.2(B) U2.19(GP14)
$1N5335: S3.2(B) U2.20(GP15)
$1N5661: R9.1 U5.1(K)
$1N5846: U2.16(GP12) U6.2(A)
$1N6464: R1.1 R2.2 U1.4(VFB)
$1N6491: CN3A.3 CN3B.3 U2.6(GP4)
$1N6499: CN3A.4 CN3B.4 U2.7(GP5)
$1N8080: R8.1 SW3.2(Collector) U2.31(GP26)
$1N10018: R5.2 SW3.4(Anode)
$1N10344: 6050.10(REGOUT) C6.1
$1N10346: 6050.20(CPOUT) C8.1
$1N10354: 6050.24(SDA) R12.1
$1N10355: 6050.23(SCL) R13.1
$1N10423: R12.2 U2.14(GP10)
$1N10437: R13.2 U2.15(GP11)
$1N10483: 6050.13(VDD) C7.2 R11.1
$1N10555: 6050.12(INT) U2.12(GP9)
$1N10722: RESET.3(C) U2.30(RUN)
$1N11952: CN1A.3 CN1B.3 Q4.3(D) R16.1
$1N11953: CN1A.4 CN1B.4 Q3.3(D) R17.1
$1N11956: Q3.2(S) R14.1 U2.2(GP1)
$1N12018: Q4.2(S) R15.1 U2.1(GP0)
$1N12552: Q5.3(D) R18.1 SERVO.3
$1N12566: Q5.2(S) R19.1 U2.9(GP6)
$1N14780: R10.2 U6.1(K)
$1N17347: C3.2 C4.2 U1.3(VIN) U1.5(EN) U10.3(K)
$1N17367: BATTERY.2(+) CHARGE.2(+) U9.1(A) U9.2(A) U10.1(A) U10.2(A)
$1N22081: CN2.3 U2.4(GP2)
$1N22089: CN2.4 U2.5(GP3)
$1N24831: BUZZER.2 D3.2(A) Q6.3(C)
$1N24878: Q6.1(B) R21.2

Not connected (* = marked no-connect by the designer): 6050 2(NC)* 3(NC)* 4(NC)* 5(NC)* 6(AUX_DA)* 7(AUX_CL)* 14(NC)* 15(NC)* 16(NC)* 17(NC)* 19(RESV)* 21(RESV)* 22(RESV)* 25(EP)*; BUZZER 3* 4*; CN1A 0*; CN1B 0*; CN2 0*; CN3A 0*; CN3B 0*; LED10 2(DOUT)*; RESET 1(A)* 4(D)*; S1 1(A)* 4(D)*; S2 1(A)* 4(D)*; S3 1(A)* 4(D)*; U2 37(3V3_EN)*; U3 1(EN#)* 10(VDD)*; U4 1(EN#)* 10(VDD)*
